# Altium schematic sheet sk9822.SchDoc
size A; SheetNumber: 2; SheetTotal: 5
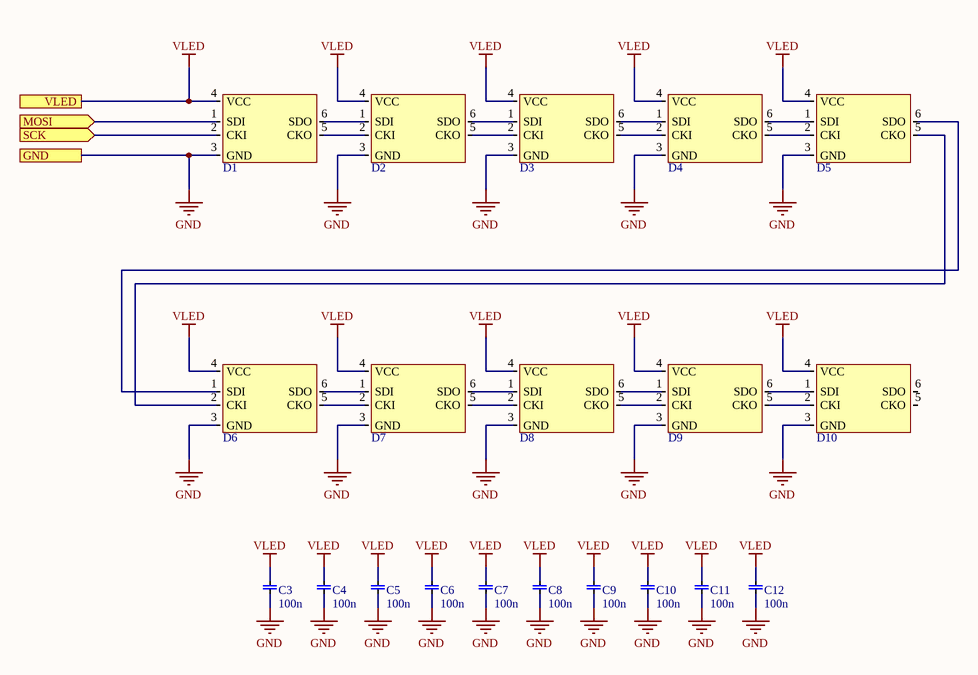
[diagram p0: sk9822.SchDoc]

## Parts
C3  value 100n  [1206, capasitor]  (hidden comment: 1206, capacitor)
C4  value 100n  [1206, capasitor]  (hidden comment: 1206, capacitor)
C5  value 100n  [1206, capasitor]  (hidden comment: 1206, capacitor)
C6  value 100n  [1206, capasitor]  (hidden comment: 1206, capacitor)
C7  value 100n  [1206, capasitor]  (hidden comment: 1206, capacitor)
C8  value 100n  [1206, capasitor]  (hidden comment: 1206, capacitor)
C9  value 100n  [1206, capasitor]  (hidden comment: 1206, capacitor)
C10  value 100n  [1206, capasitor]  (hidden comment: 1206, capacitor)
C11  value 100n  [1206, capasitor]  (hidden comment: 1206, capacitor)
C12  value 100n  [1206, capasitor]  (hidden comment: 1206, capacitor)
D1  Neo - SK9822  [SK9822]  (value not drawn)
D2  Neo - SK9822  [SK9822]  (value not drawn)
D3  Neo - SK9822  [SK9822]  (value not drawn)
D4  Neo - SK9822  [SK9822]  (value not drawn)
D5  Neo - SK9822  [SK9822]  (value not drawn)
D6  Neo - SK9822  [SK9822]  (value not drawn)
D7  Neo - SK9822  [SK9822]  (value not drawn)
D8  Neo - SK9822  [SK9822]  (value not drawn)
D9  Neo - SK9822  [SK9822]  (value not drawn)
D10  Neo - SK9822  [SK9822]  (value not drawn)

## Ports
GND, MOSI (in), SCK (in), VLED

## Nets
GND: C3.0 C4.0 C5.0 C6.0 C7.0 C8.0 C9.0 C10.0 C11.0 C12.0 D1.3(GND) D2.3(GND) D3.3(GND) D4.3(GND) D5.3(GND) D6.3(GND) D7.3(GND) D8.3(GND) D9.3(GND) D10.3(GND) ; port GND
VLED: C3.1 C4.1 C5.1 C6.1 C7.1 C8.1 C9.1 C10.1 C11.1 C12.1 D1.4(VCC) D2.4(VCC) D3.4(VCC) D4.4(VCC) D5.4(VCC) D6.4(VCC) D7.4(VCC) D8.4(VCC) D9.4(VCC) D10.4(VCC) ; port VLED
MOSI: D1.1(SDI) ; port MOSI
SCK: D1.2(CKI) ; port SCK
NetD1_5: D1.5(CKO) D2.2(CKI)
NetD1_6: D1.6(SDO) D2.1(SDI)
NetD2_5: D2.5(CKO) D3.2(CKI)
NetD2_6: D2.6(SDO) D3.1(SDI)
NetD3_5: D3.5(CKO) D4.2(CKI)
NetD3_6: D3.6(SDO) D4.1(SDI)
NetD4_5: D4.5(CKO) D5.2(CKI)
NetD4_6: D4.6(SDO) D5.1(SDI)
NetD5_5: D5.5(CKO) D6.2(CKI)
NetD5_6: D5.6(SDO) D6.1(SDI)
NetD6_5: D6.5(CKO) D7.2(CKI)
NetD6_6: D6.6(SDO) D7.1(SDI)
NetD7_5: D7.5(CKO) D8.2(CKI)
NetD7_6: D7.6(SDO) D8.1(SDI)
NetD8_5: D8.5(CKO) D9.2(CKI)
NetD8_6: D8.6(SDO) D9.1(SDI)
NetD9_5: D9.5(CKO) D10.2(CKI)
NetD9_6: D9.6(SDO) D10.1(SDI)

Not connected (* = marked no-connect by the designer): D10 5(CKO) 6(SDO)

## Library data of the parts
C3-C12 = 1206, capacitor: Manufacturer Part Number: CL31B104KBCNNNC; JLCPCB Part #: C24497; Mount: Yes
D1-D10 = Neo - SK9822: JLCPCB Part #: C2829089; Manufacturer Part Number: SK9822; Mount: Yes